# EAGLE design ServoCity (EAGLE 6.6.0)
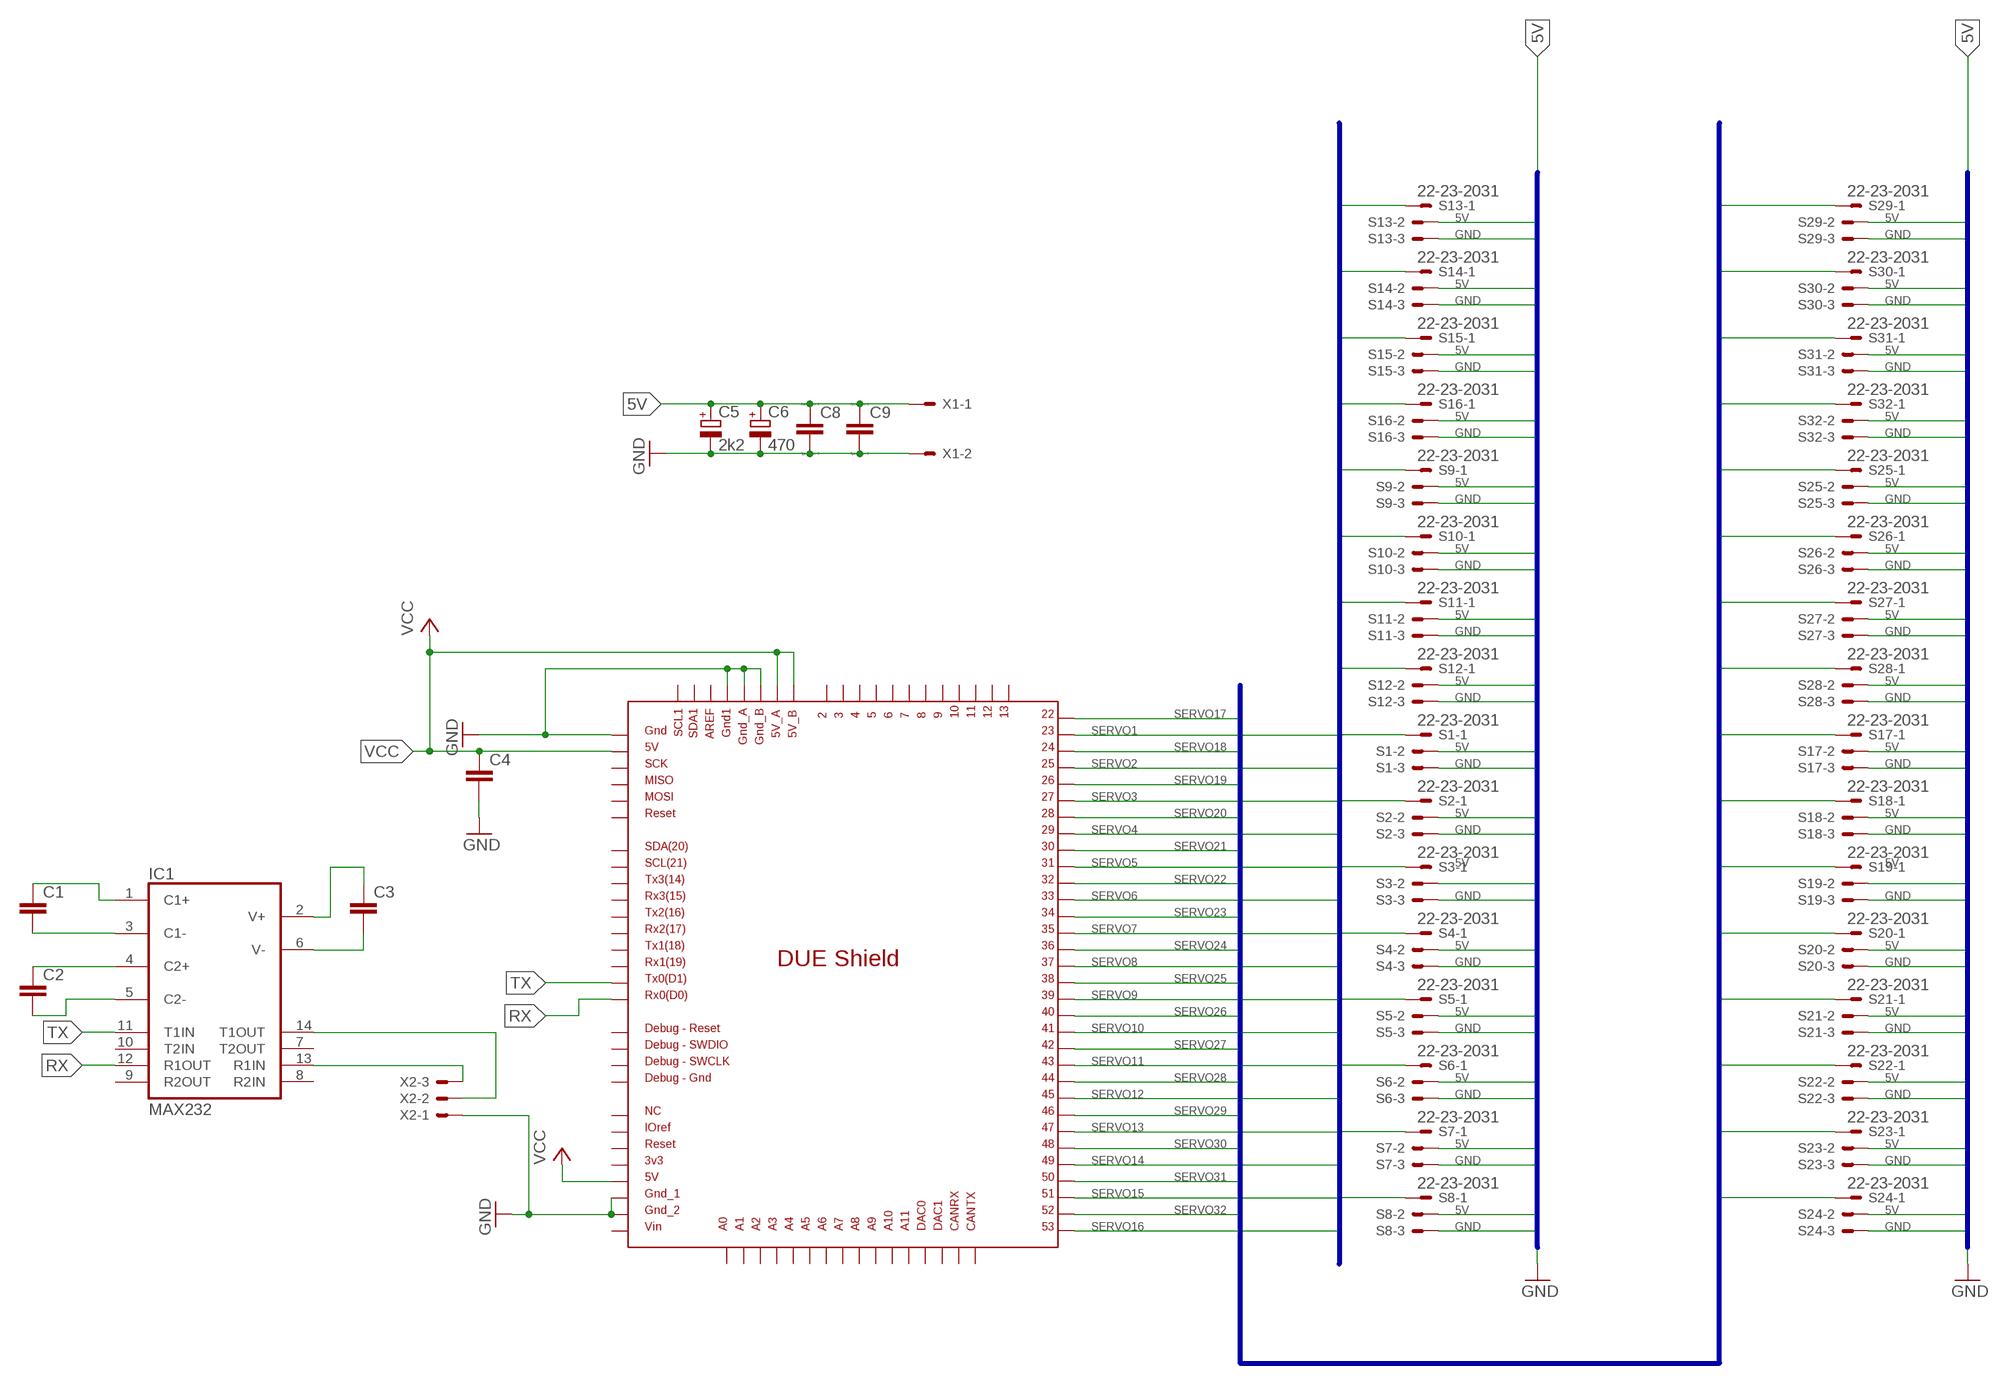
[diagram p0: schematic, sheet 1]

## Parts
C1  C-EUC0805  [C0805]
C2  C-EUC0805  [C0805]
C3  C-EUC0805  [C0805]
C4  C-EUC0805  [C0805]
C5  2k2  CPOL-EUE10-20  [EB20D]
C6  470  CPOL-EUE5-10.5  [E5-10,5]
C8  C  [C0805]
C9  C  [C0805]
IC1  MAX232  [DIL16]
S1  22-23-2031  [22-23-2031]
S2  22-23-2031  [22-23-2031]
S3  22-23-2031  [22-23-2031]
S4  22-23-2031  [22-23-2031]
S5  22-23-2031  [22-23-2031]
S6  22-23-2031  [22-23-2031]
S7  22-23-2031  [22-23-2031]
S8  22-23-2031  [22-23-2031]
S9  22-23-2031  [22-23-2031]
S10  22-23-2031  [22-23-2031]
S11  22-23-2031  [22-23-2031]
S12  22-23-2031  [22-23-2031]
S13  22-23-2031  [22-23-2031]
S14  22-23-2031  [22-23-2031]
S15  22-23-2031  [22-23-2031]
S16  22-23-2031  [22-23-2031]
S17  22-23-2031  [22-23-2031]
S18  22-23-2031  [22-23-2031]
S19  22-23-2031  [22-23-2031]
S20  22-23-2031  [22-23-2031]
S21  22-23-2031  [22-23-2031]
S22  22-23-2031  [22-23-2031]
S23  22-23-2031  [22-23-2031]
S24  22-23-2031  [22-23-2031]
S25  22-23-2031  [22-23-2031]
S26  22-23-2031  [22-23-2031]
S27  22-23-2031  [22-23-2031]
S28  22-23-2031  [22-23-2031]
S29  22-23-2031  [22-23-2031]
S30  22-23-2031  [22-23-2031]
S31  22-23-2031  [22-23-2031]
S32  22-23-2031  [22-23-2031]
U$1  DUE(NORMAL)  [DUE(NORMAL)]
X1  KK-156-2  [KK-156-2]
X2  KK-156-3  [KK-156-3]

## Nets
5V [5V]: C5.+ C6.+ C8.1 C9.1 S1.2 S2.2 S3.2 S4.2 S5.2 S6.2 S7.2 S8.2 S9.2 S10.2 S11.2 S12.2 S13.2 S14.2 S15.2 S16.2 S17.2 S18.2 S19.2 S20.2 S21.2 S22.2 S23.2 S24.2 S25.2 S26.2 S27.2 S28.2 S29.2 S30.2 S31.2 S32.2 X1.1
GND [GND]: C4.2 C5.- C6.- C8.2 C9.2 S1.3 S2.3 S3.3 S4.3 S5.3 S6.3 S7.3 S8.3 S9.3 S10.3 S11.3 S12.3 S13.3 S14.3 S15.3 S16.3 S17.3 S18.3 S19.3 S20.3 S21.3 S22.3 S23.3 S24.3 S25.3 S26.3 S27.3 S28.3 S29.3 S30.3 S31.3 S32.3 U$1.5V_ICSP U$1.GND1 U$1.GND_1 U$1.GND_2 U$1.GND_A U$1.GND_B X1.2 X2.1
N$1 [5V]: IC1.14(T1OUT) X2.2
N$2 [5V]: IC1.13(R1IN) X2.3
N$3 [5V]: C1.1 IC1.1(C1+)
N$4 [5V]: C1.2 IC1.3(C1-)
N$5 [5V]: C2.1 IC1.4(C2+)
N$6 [5V]: C2.2 IC1.5(C2-)
N$7 [5V]: C3.1 IC1.2(V+)
N$8 [5V]: C3.2 IC1.6(V-)
RX [5V]: IC1.12(R1OUT) U$1.RX0
SERVO1 [5V]: S1.1 U$1.23
SERVO2 [5V]: S2.1 U$1.25
SERVO3 [5V]: S3.1 U$1.27
SERVO4 [5V]: S4.1 U$1.29
SERVO5 [5V]: S5.1 U$1.31
SERVO6 [5V]: S6.1 U$1.33
SERVO7 [5V]: S7.1 U$1.35
SERVO8 [5V]: S8.1 U$1.37
SERVO9 [5V]: S9.1 U$1.39
SERVO10 [5V]: S10.1 U$1.41
SERVO11 [5V]: S11.1 U$1.43
SERVO12 [5V]: S12.1 U$1.45
SERVO13 [5V]: S13.1 U$1.47
SERVO14 [5V]: S14.1 U$1.49
SERVO15 [5V]: S15.1 U$1.51
SERVO16 [5V]: S16.1 U$1.53
SERVO17 [5V]: S17.1 U$1.22
SERVO18 [5V]: S18.1 U$1.24
SERVO19 [5V]: S19.1 U$1.26
SERVO20 [5V]: S20.1 U$1.28
SERVO21 [5V]: S21.1 U$1.30
SERVO22 [5V]: S22.1 U$1.32
SERVO23 [5V]: S23.1 U$1.34
SERVO24 [5V]: S24.1 U$1.36
SERVO25 [5V]: S25.1 U$1.38
SERVO26 [5V]: S26.1 U$1.40
SERVO27 [5V]: S27.1 U$1.42
SERVO28 [5V]: S28.1 U$1.44
SERVO29 [5V]: S29.1 U$1.46
SERVO30 [5V]: S30.1 U$1.48
SERVO31 [5V]: S31.1 U$1.50
SERVO32 [5V]: S32.1 U$1.52
TX [5V]: IC1.11(T1IN) U$1.TX0
VCC [5V]: C4.1 U$1.5V U$1.5V_A U$1.5V_B U$1.GND_ICSP
Unconnected: IC1.7(T2OUT) IC1.8(R2IN) IC1.9(R2OUT) IC1.10(T2IN) U$1.2 U$1.3 U$1.3V3 U$1.4 U$1.5 U$1.6 U$1.7 U$1.8 U$1.9 U$1.10 U$1.11 U$1.12 U$1.13 U$1.A0 U$1.A1 U$1.A2 U$1.A3 U$1.A4 U$1.A5 U$1.A6 U$1.A7 U$1.A8 U$1.A9 U$1.A10 U$1.A11 U$1.AREF U$1.CANRX U$1.CANTX U$1.DAC0 U$1.DAC1 U$1.GND_DEBUG U$1.IOREF U$1.MISO_ICSP U$1.MOSI_ICSP U$1.NC U$1.RESET U$1.RESET_DEBUG U$1.RESET_ICSP U$1.RX1 U$1.RX2 U$1.RX3 U$1.SCK_ICSP U$1.SCL U$1.SCL1 U$1.SDA U$1.SDA1 U$1.SWCLK_DEBUG U$1.SWDIO_DEBUG U$1.TX1 U$1.TX2 U$1.TX3 U$1.VIN

## Buses
SERVO[1..16]
5V,GND
SERVO[17..32]

## Power pins joined to a net without a drawn wire
GND: IC1.15(GND)
VCC: IC1.16(VCC)

## Library data of the parts
C1-C4 = rcl:C-EU: CAPACITOR, European symbol
C5 C6 = rcl:CPOL-EU: POLARIZED CAPACITOR, European symbol
C8 C9 = eagle-ltspice:C: CAPACITOR, European symbol; SPICEMODEL: NONE; SPICEPREFIX: C
IC1 = maxim:MAX232: RS232 TRANSCEIVER; MF: MAXIM; MPN: MAX232ACPE+; OC_FARNELL: 9723773; OC_NEWARK: 68K4544
S1-S32 = con-molex:22-23-2031: .100" (2.54mm) Center Header - 3 Pin; MF: MOLEX; MPN: 22-23-2031; OC_FARNELL: 1462950; OC_NEWARK: 30C0862
U$1 = DUElib130425:DUE(NORMAL)
X1 = con-molex:KK-156-2: KK 156 HEADER Source: http://www.molex.com/pdm_docs/sd/026604100_sd.pdf; OC_FARNELL: unknown; OC_NEWARK: unknown
X2 = con-molex:KK-156-3: KK 156 HEADER Source: http://www.molex.com/pdm_docs/sd/026604100_sd.pdf; OC_FARNELL: unknown; OC_NEWARK: unknown

## Net classes
0 default: clearance 0.508 mm
1 5V: width 2.54 mm, clearance 0.508 mm
2 GND: width 2.54 mm, clearance 0.508 mm

## Board
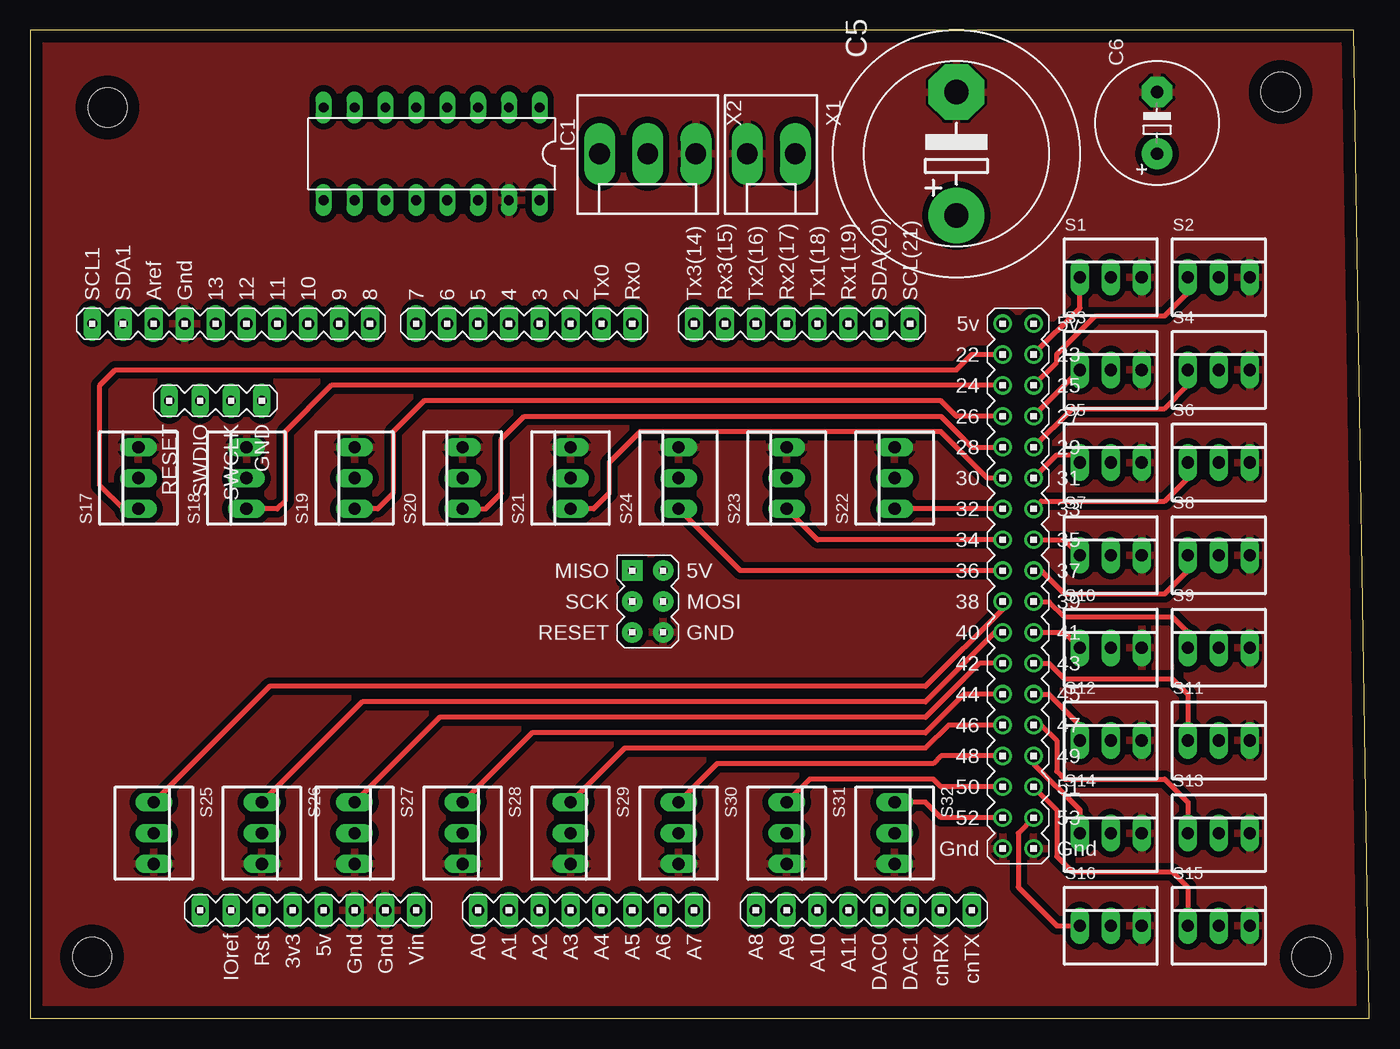
[diagram p1: board, top side]
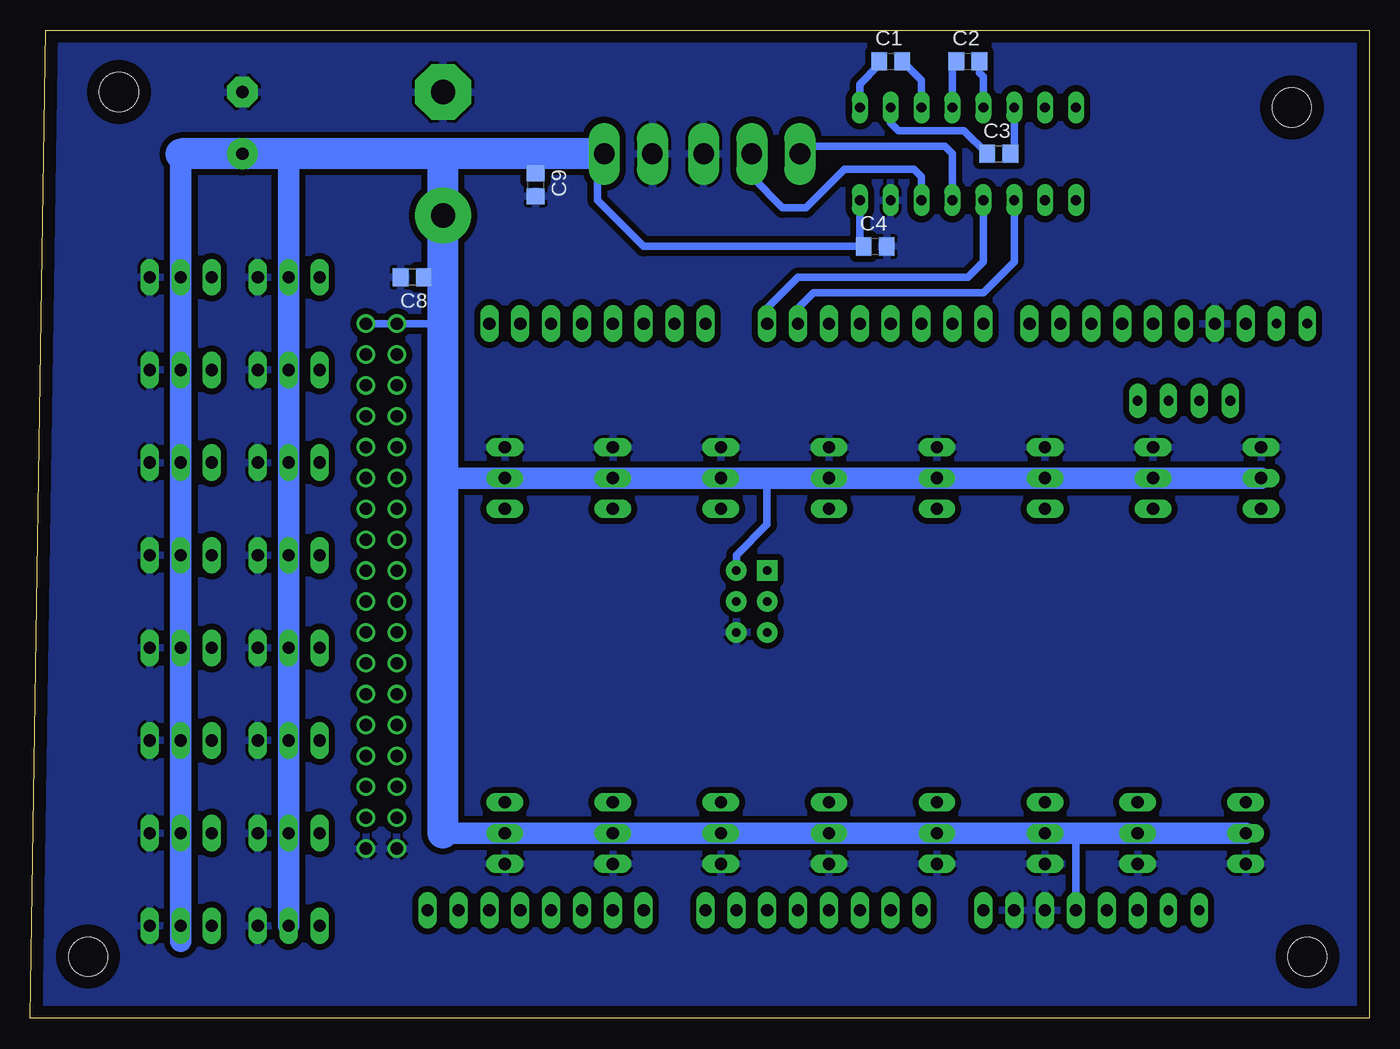
[diagram p2: board, bottom side, seen from below]

Size 110.16 x 81.27 mm. Coordinates in mm from the lower left corner, seen from the top.
Outline: 0,0 110.16,0 108.89,81.27 0,81.27 0,0
Copper layers (1*16): Top 0.035mm / dielectric 1.5mm / Bottom 0.035mm
Design rules "default": minimum track width 10mil, minimum drill 24mil, track to track 8mil, track to pad 8mil, pad to pad 8mil, via to via 8mil, smd to smd 8mil, copper to edge 40mil, drill to drill 8mil, minimum pad ring 10mil, minimum via ring 8mil, stop-mask expansion 4mil, vias tented up to drill 0mil, thermal gap 10mil
Holes 3.2 mm at 6.35,74.93 102.87,76.2 105.41,5.08 5.08,5.08

### Footprints (pad centres in the part's own frame; a part is rotated, then mirrored left to right if it is on the bottom)
C0805 = smd 1.3 x 1.5: 1 -0.95,0; 2 0.95,0
EB20D = drill 2.007 pad 4.597: + -5.08,0 | drill 2.007 pad 4.597 octagon: - 5.08,0
E5-10,5 = drill 1.016 pad 2.54: + -2.54,0 | drill 1.016 pad 2.54 octagon: - 2.54,0
DIL16 = drill 0.813 long: 1 -8.89,-3.81; 2 -6.35,-3.81; 3 -3.81,-3.81; 4 -1.27,-3.81; 5 1.27,-3.81; 6 3.81,-3.81; 7 6.35,-3.81; 8 8.89,-3.81; 9 8.89,3.81; 10 6.35,3.81; 11 3.81,3.81; 12 1.27,3.81; 13 -1.27,3.81; 14 -3.81,3.81; 15 -6.35,3.81; 16 -8.89,3.81
22-23-2031 = drill 1 long: 1 -2.54,0; 2 0,0; 3 2.54,0
DUE(NORMAL) = drill 1 long: 2 -16.51,30.48; 3 -19.05,30.48; 3V3 -39.37,-17.78; 4 -21.59,30.48; 5 -24.13,30.48; 5V -36.83,-17.78; 6 -26.67,30.48; 7 -29.21,30.48; 8 -33.02,30.48; 9 -35.56,30.48; 10 -38.1,30.48; 11 -40.64,30.48; 12 -43.18,30.48; 13 -45.72,30.48; A0 -24.13,-17.78; A1 -21.59,-17.78; A2 -19.05,-17.78; A3 -16.51,-17.78; A4 -13.97,-17.78; A5 -11.43,-17.78; A6 -8.89,-17.78; A7 -6.35,-17.78; A8 -1.27,-17.78; A9 1.27,-17.78; A10 3.81,-17.78; A11 6.35,-17.78; AREF -50.8,30.48; AREF1 -50.8,30.48; CANRX 13.97,-17.78; CANTX 16.51,-17.78; DAC0 8.89,-17.78; DAC1 11.43,-17.78; GND1 -48.26,30.48; GND_1 -34.29,-17.78; GND_2 -31.75,-17.78; RESET -41.91,-17.78; RX0 -11.43,30.48; RX1 6.35,30.48; RX2 1.27,30.48; RX3 -3.81,30.48; SCL 11.43,30.48; SDA 8.89,30.48; TX0 -13.97,30.48; TX1 3.81,30.48; TX2 -1.27,30.48; TX3 -6.35,30.48; VIN -29.21,-17.78 | drill 1: 5V_A 19.05,30.48; 5V_B 21.59,30.48; 22 19.05,27.94; 23 21.59,27.94; 24 19.05,25.4; 25 21.59,25.4; 26 19.05,22.86; 27 21.59,22.86; 28 19.05,20.32; 29 21.59,20.32; 30 19.05,17.78; 31 21.59,17.78; 32 19.05,15.24; 33 21.59,15.24; 34 19.05,12.7; 35 21.59,12.7; 36 19.05,10.16; 37 21.59,10.16; 38 19.05,7.62; 39 21.59,7.62; 40 19.05,5.08; 41 21.59,5.08; 42 19.05,2.54; 43 21.59,2.54; 44 19.05,0; 45 21.59,0; 46 19.05,-2.54; 47 21.59,-2.54; 48 19.05,-5.08; 49 21.59,-5.08; 50 19.05,-7.62; 51 21.59,-7.62; 52 19.05,-10.16; 53 21.59,-10.16; GND_A 19.05,-12.7; GND_B 21.59,-12.7 | drill 0.7 pad 1.676: 5V_ICSP -8.89,5.08; GND_ICSP -8.89,10.16; MOSI_ICSP -8.89,7.62; RESET_ICSP -11.43,5.08; SCK_ICSP -11.43,7.62 | drill 0.8 pad 1.422 long: GND_DEBUG -41.91,24.13; IOREF -44.45,-17.78; NC -46.99,-17.78; RESET_DEBUG -49.53,24.13; SCL1 -55.88,30.48; SDA1 -53.34,30.48; SWCLK_DEBUG -44.45,24.13; SWDIO_DEBUG -46.99,24.13 | drill 0.7 pad 1.676 square: MISO_ICSP -11.43,10.16
KK-156-2 = drill 1.7 pad 2.184 long: 1 -1.98,0; 2 1.98,0
KK-156-3 = drill 1.7 pad 2.184 long: 1 -3.96,0; 2 0,0; 3 3.96,0

### Placement (x,y rotation side)
C1  39.37,78.74 0 bottom
C2  33.02,78.74 0 bottom
C3  30.48,71.12 0 bottom
C4  40.64,63.5 0 bottom
C5  76.2,71.12 90 top
C6  92.71,73.66 90 top
C8  78.74,60.96 180 bottom
C9  68.58,68.58 270 bottom
IC1  33.02,71.12 180 top
S1  88.9,60.96 0 top
S2  97.79,60.96 0 top
S3  88.9,53.34 0 top
S4  97.79,53.34 0 top
S5  88.9,45.72 0 top
S6  97.79,45.72 0 top
S7  88.9,38.1 0 top
S8  97.79,38.1 0 top
S9  97.79,30.48 0 top
S10  88.9,30.48 0 top
S11  97.79,22.86 0 top
S12  88.9,22.86 0 top
S13  97.79,15.24 0 top
S14  88.9,15.24 0 top
S15  97.79,7.62 0 top
S16  88.9,7.62 0 top
S17  8.89,44.45 90 top
S18  17.78,44.45 90 top
S19  26.67,44.45 90 top
S20  35.56,44.45 90 top
S21  44.45,44.45 90 top
S22  71.12,44.45 90 top
S23  62.23,44.45 90 top
S24  53.34,44.45 90 top
S25  10.16,15.24 270 top
S26  19.05,15.24 270 top
S27  26.67,15.24 270 top
S28  35.56,15.24 270 top
S29  44.45,15.24 270 top
S30  53.34,15.24 270 top
S31  62.23,15.24 270 top
S32  71.12,15.24 270 top
U$1  60.96,26.67 0 top
X1  60.96,71.12 180 top
X2  50.8,71.12 180 top

### Tracks (layer width: path | path; a pad name or v marks a point on that pad's centre or on a via)
5V
  Bottom 0.61: 59.69,63.5 63.5,67.31 63.5,71.12 | C8.1 76.2,60.96 | 68.58,71.12 C9.1
  Bottom 1.778: 97.79,71.12 S2.2 S4.2 S6.2 S8.2 S9.2 S11.2 S13.2 S15.2 97.79,6.35 | S16.2 S14.2 | 88.9,16.51 S14.2 | S14.2 S12.2 S10.2 S7.2 S5.2 S3.2 S1.2 88.9,71.12 | 76.2,44.45 S22.2 S23.2 S24.2 S21.2 S20.2 S19.2 S18.2 S17.2 | 76.2,15.24 S32.2 S31.2 S30.2 | 52.07,15.24 S30.2 | S30.2 S29.2 S28.2 S27.2 S26.2 S25.2
  Bottom 2.54: X1.1 63.5,71.12 68.58,71.12 76.2,71.12 | 76.2,71.12 88.9,71.12 C6.+ 97.79,71.12 | 76.2,71.12 C5.+ 76.2,60.96 76.2,44.45 76.2,15.24
GND
  pour Bottom: 0,81.28 110.49,81.28 110.49,0 0,0 0,80.01
  pour Top: 0,81.28 110.49,81.28 110.49,0 0,0
N$1
  Bottom 0.61: IC1.14 36.83,69.22 37.47,69.85 43.18,69.85 46.35,66.67 48.26,66.67 50.8,69.22 X2.2
N$2
  Bottom 0.61: IC1.13 34.29,71.12 34.92,71.75 46.2,71.75 X2.3
N$3
  Bottom 0.61: C1.1 40.32,78.42 41.91,76.83 IC1.1
N$4
  Bottom 0.61: IC1.3 36.83,77.15 C1.2
N$5
  Bottom 0.61: IC1.4 34.29,78.42 C2.1
N$6
  Bottom 0.61: C2.2 32.07,77.79 31.75,77.47 IC1.5
N$7
  Bottom 0.61: IC1.2 39.37,73.66 38.73,73.03 33.34,73.03 C3.1
N$8
  Bottom 0.61: IC1.6 29.21,71.44 C3.2
RX
  Bottom 0.61: U$1.RX0 49.53,58.42 46.99,60.96 33.02,60.96 31.75,62.23 IC1.12
SERVO1
  Top 0.406: U$1.23 86.36,58.42 S1.1
SERVO2
  Top 0.406: U$1.25 84.45,53.98 84.45,54.61 87.63,57.78 93.34,57.78 95.25,59.69 S2.1
SERVO3
  Top 0.406: U$1.27 S3.1
SERVO4
  Top 0.406: U$1.29 85.72,50.16 93.34,50.16 95.25,52.07 S4.1
SERVO5
  Top 0.406: U$1.31 84.45,46.35 85.72,46.35 S5.1
SERVO6
  Top 0.406: U$1.33 83.19,42.55 93.34,42.55 95.25,44.45 S6.1
SERVO7
  Top 0.406: U$1.35 85.09,39.37 S7.1
SERVO8
  Top 0.406: U$1.37 83.19,36.83 85.09,34.92 93.34,34.92 95.25,36.83 S8.1
SERVO9
  Top 0.406: U$1.39 83.82,34.29 85.09,33.02 93.98,33.02 95.25,31.75 S9.1
SERVO10
  Top 0.406: U$1.41 85.09,31.75 S10.1
SERVO11
  Top 0.406: U$1.43 83.82,29.21 85.09,27.94 93.98,27.94 95.25,26.67 S11.1
SERVO12
  Top 0.406: U$1.45 83.82,26.67 86.36,24.13 S12.1
SERVO13
  Top 0.406: U$1.47 83.19,24.13 84.45,22.86 84.45,20.32 85.09,19.68 93.34,19.68 95.25,17.78 S13.1
SERVO14
  Top 0.406: U$1.49 82.55,20.95 86.36,17.14 S14.1
SERVO15
  Top 0.406: U$1.51 84.45,17.14 84.45,13.34 85.72,12.06 93.98,12.06 95.25,10.79 S15.1
SERVO16
  Top 0.406: U$1.53 81.28,15.24 81.28,10.79 84.45,7.62 S16.1
SERVO17
  Top 0.406: S17.1 7.62,41.91 5.71,43.81 5.71,52.07 6.99,53.34 76.2,53.34 77.47,54.61 U$1.22
SERVO18
  Top 0.406: U$1.24 24.77,52.07 20.95,48.26 20.95,42.55 20.32,41.91 S18.1
SERVO19
  Top 0.406: U$1.26 76.2,49.53 74.93,50.8 32.38,50.8 29.84,48.26 29.84,43.18 28.57,41.91 S19.1
SERVO20
  Top 0.406: S20.1 37.47,41.91 38.73,43.18 38.73,47.62 40.64,49.53 74.93,49.53 77.47,46.99 U$1.28
SERVO21
  Top 0.406: U$1.30 78.74,44.45 74.93,48.26 50.16,48.26 47.62,45.72 47.62,43.18 46.35,41.91 S21.1
SERVO22
  Top 0.406: U$1.32 S22.1
SERVO23
  Top 0.406: U$1.34 64.77,39.37 S23.1
SERVO24
  Top 0.406: U$1.36 58.42,36.83 S24.1
SERVO25
  Top 0.406: U$1.38 80.01,33.66 73.66,27.3 19.68,27.3 S25.1
SERVO26
  Top 0.406: U$1.40 79.38,31.75 73.66,26.04 27.3,26.04 S26.1
SERVO27
  Top 0.406: U$1.42 78.11,29.21 73.66,24.77 33.66,24.77 S27.1
SERVO28
  Top 0.406: U$1.44 76.83,26.67 73.66,23.5 41.27,23.5 S28.1
SERVO29
  Top 0.406: U$1.46 75.56,24.13 73.66,22.23 48.9,22.23 S29.1
SERVO30
  Top 0.406: U$1.48 74.93,21.59 74.3,20.95 56.52,20.95 S30.1
SERVO31
  Top 0.406: U$1.50 74.93,19.05 74.3,19.68 64.14,19.68 S31.1
SERVO32
  Top 0.406: U$1.52 74.93,16.51 73.66,17.78 S32.1
TX
  Bottom 0.61: U$1.TX0 46.99,58.42 45.72,59.69 31.75,59.69 29.21,62.23 IC1.11
VCC
  Bottom 0.61: IC1.16 41.91,63.82 C4.1 59.69,63.5 63.5,67.31 63.5,71.12 76.2,71.12 76.2,57.15 | U$1.GND_ICSP 52.07,38.1 49.53,40.64 49.53,44.45 76.2,44.45 | 76.2,44.45 76.2,57.15 | 76.2,57.15 U$1.5V_A U$1.5V_B | U$1.5V 24.13,15.24 76.2,15.24 76.2,44.45